# EAGLE design meter_mode (EAGLE 7.3.0)
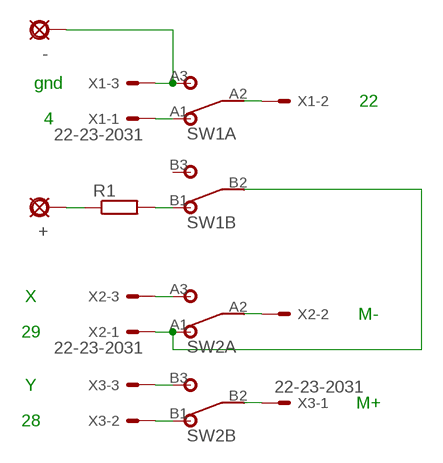
[diagram p0: schematic, sheet 1]

## Parts
+  PADO  [ROUND]
-  PAD  [SQUARE]
R1  R-EU_0204/2V  [0204V]
SW1  DPDT  [DPDT]
SW2  DPDT  [DPDT]
X1  22-23-2031  [22-23-2031]
X2  22-23-2031  [22-23-2031]
X3  22-23-2031  [22-23-2031]

## Nets
N$1: SW2.A3 X2.3
N$2: SW1.B2 SW2.A1 X2.1
N$3: SW1.A1 X1.1
N$4: SW2.B3 X3.3
N$5: SW2.B1 X3.2
N$6: SW2.B2 X3.1
N$7: SW2.A2 X2.2
N$8: SW1.A2 X1.2
N$9: R1.2 SW1.B1
N$10: -.1(PAD) SW1.A3 X1.3
N$11: +.1(PAD) R1.1
Unconnected: SW1.B3

## Notes on the sheet
- gnd
- 22
- 4
- X
- M-
- 29
- Y
- M+
- 28

## Library data of the parts
+ - = gm-supply:PAD: PAD use this package for pads with any purpose, including input, output, send or return various pad shapes: round, square, octogonal, long, and long offset
R1 = rcl:R-EU_: RESISTOR, European symbol
SW1 SW2 = gm-switches:DPDT
X1-X3 = con-molex:22-23-2031: .100" (2.54mm) Center Header - 3 Pin; MF: MOLEX; MPN: 22-23-2031; OC_FARNELL: 1462950; OC_NEWARK: 30C0862

## Board
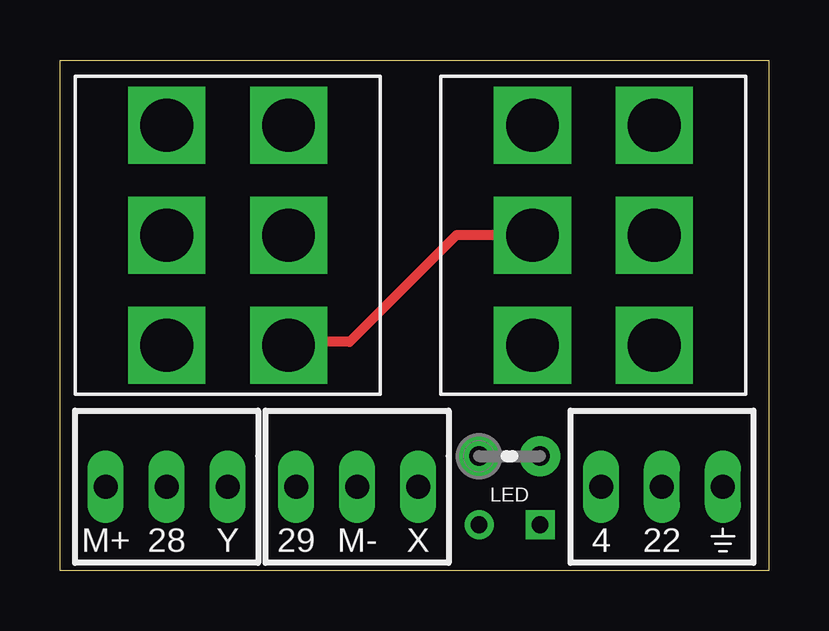
[diagram p1: board, top side]
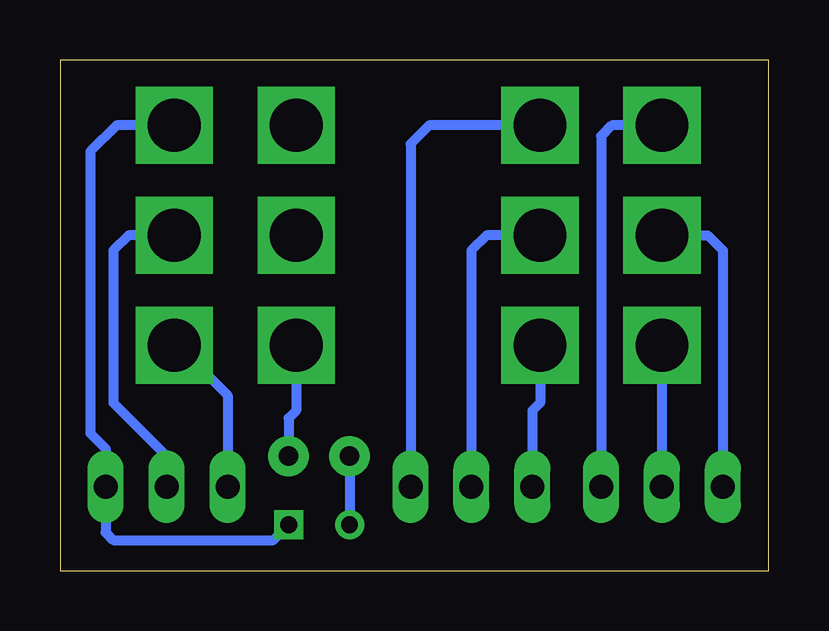
[diagram p2: board, bottom side, seen from below]

Size 29.53 x 21.27 mm. Coordinates in mm from the lower left corner, seen from the top.
Outline: 0,0 0,21.27 29.53,21.27 29.53,0 0,0
Copper layers (1*16): Top 0.035mm / dielectric 1.5mm / Bottom 0.035mm
Design rules "default": minimum track width 10mil, minimum drill 24mil, track to track 8mil, track to pad 8mil, pad to pad 8mil, via to via 8mil, smd to smd 8mil, copper to edge 40mil, drill to drill 8mil, minimum pad ring 10mil, minimum via ring 8mil, stop-mask expansion 4mil, vias tented up to drill 0mil, thermal gap 10mil

### Footprints (pad centres in the part's own frame; a part is rotated, then mirrored left to right if it is on the bottom)
ROUND = drill 0.7: 1 0,0
SQUARE = drill 0.7 square: 1 0,0
0204V = drill 0.813 pad 1.676: 1 -1.27,0; 2 1.27,0
DPDT = drill 2.2 square: A1 -2.54,4.58; A2 -2.54,0; A3 -2.54,-4.58; B1 2.54,4.58; B2 2.54,0; B3 2.54,-4.58
22-23-2031 = drill 1 long: 1 -2.54,0; 2 0,0; 3 2.54,0

### Placement (x,y rotation side)
+  17.46,1.91 0 top
-  20,1.91 0 top
R1  18.73,4.76 0 top
SW1  22.22,13.97 180 top
SW2  6.99,13.97 180 top
X1  25.08,3.49 0 top
X2  12.38,3.49 0 top
X3  4.45,3.49 0 top

### Tracks (layer width: path | path; a pad name or v marks a point on that pad's centre or on a via)
N$1
  Bottom 0.406: SW2.A3 14.15,18.55 14.92,17.78 X2.3
N$2
  Top 0.406: SW1.B2 16.51,13.97 12.07,9.53 9.66,9.53 SW2.A1
  Bottom 0.406: SW2.A1 9.52,6.98 9.84,6.67 X2.1
N$3
  Bottom 0.406: SW1.A1 24.63,9.39 22.54,7.3 X1.1
N$4
  Bottom 0.406: SW2.B3 6.53,18.55 6.99,18.1 X3.3
N$5
  Bottom 0.406: SW2.B1 X3.2
N$6
  Bottom 0.406: SW2.B2 2.54,13.97 1.91,13.34 X3.1
N$7
  Bottom 0.406: SW2.A2 11.75,13.97 12.38,13.34 X2.2
N$8
  Bottom 0.406: SW1.A2 26.67,13.97 27.3,13.34 27.3,6.98 25.08,4.76 X1.2
N$9
  Bottom 0.406: SW1.B1 19.68,6.67 20,6.35 R1.2
N$10
  Bottom 0.406: SW1.A3 27.17,18.55 28.26,17.46 28.26,5.71 27.62,5.08 X1.3 27.62,1.59 27.3,1.27 20.64,1.27 -.1
N$11
  Bottom 0.406: R1.1 +.1

### Text on the board
tPlace: LED | M+ | 28 | Y | 29 | M- | X | 4 | 22